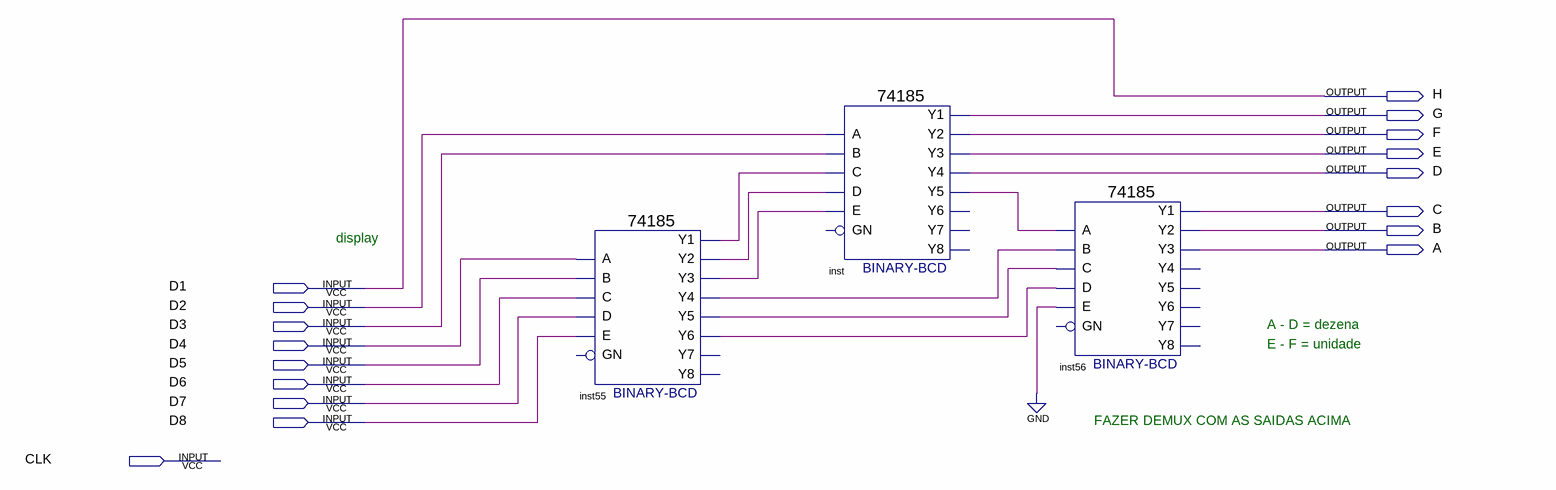
[diagram p0: schematic sheet]
// Quartus schematic teste_exemplo.bdf as structural Verilog: 3 symbols, 17 pins
module teste_exemplo (
  input  D1,
  input  D2,
  input  D3,
  input  D4,
  input  D5,
  input  D6,
  input  D7,
  input  D8,
  input  CLK,
  output H,
  output G,
  output F,
  output E,
  output D,
  output C,
  output B,
  output A
);

  wire inst55_y1, inst55_y2, inst55_y3, inst55_y4, inst55_y5, inst55_y6, inst_y5;

  \74185  inst55 (
    .A(D4), .B(D5), .D(D7), .C(D6), .E(D8), .Y1(inst55_y1), .Y3(inst55_y3), .Y2(inst55_y2), .Y5(inst55_y5),
    .Y4(inst55_y4), .Y6(inst55_y6));  // open: GN, Y8, Y7
  \74185  inst (
    .A(D2), .B(D3), .D(inst55_y2), .C(inst55_y1), .E(inst55_y3), .Y1(G), .Y3(E), .Y2(F), .Y5(inst_y5), .Y4(D));  // open: GN, Y6, Y8, Y7
  \74185  inst56 (
    .A(inst_y5), .B(inst55_y4), .D(inst55_y6), .C(inst55_y5), .E(1'b0), .Y1(C), .Y3(A), .Y2(B));  // open: GN, Y5, Y4, Y6, Y8, Y7

  assign H = D1;

  // Notes on the sheet:
  //   display
  //   A - D = dezena
  //   E - F = unidade
  //   FAZER DEMUX COM AS SAIDAS ACIMA
endmodule
